# EAGLE schematic Rephone core 2G-AtmelSAMD21 v1.0 (EAGLE 6.4)
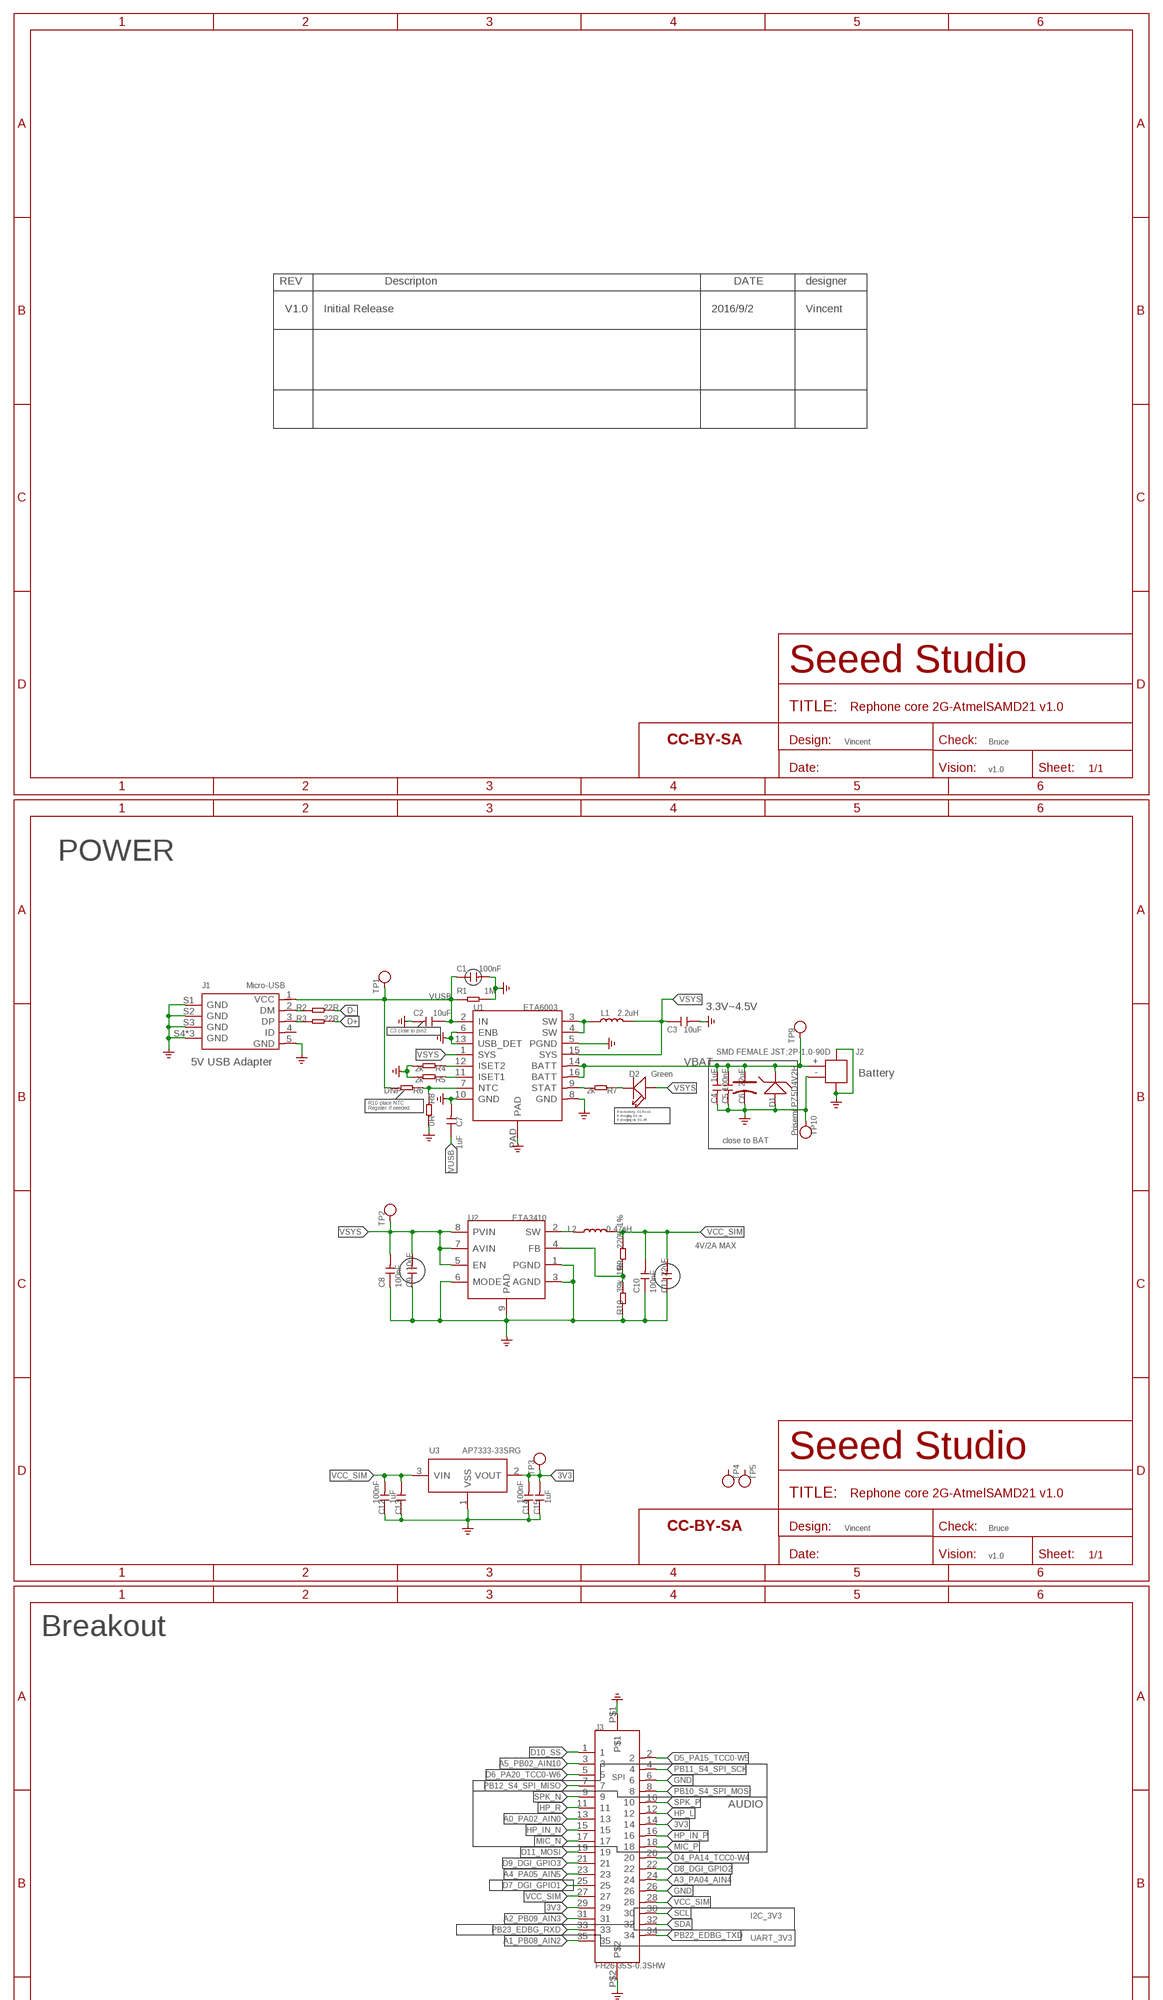
[diagram p0: schematic, sheet 1, part 1 of 2]
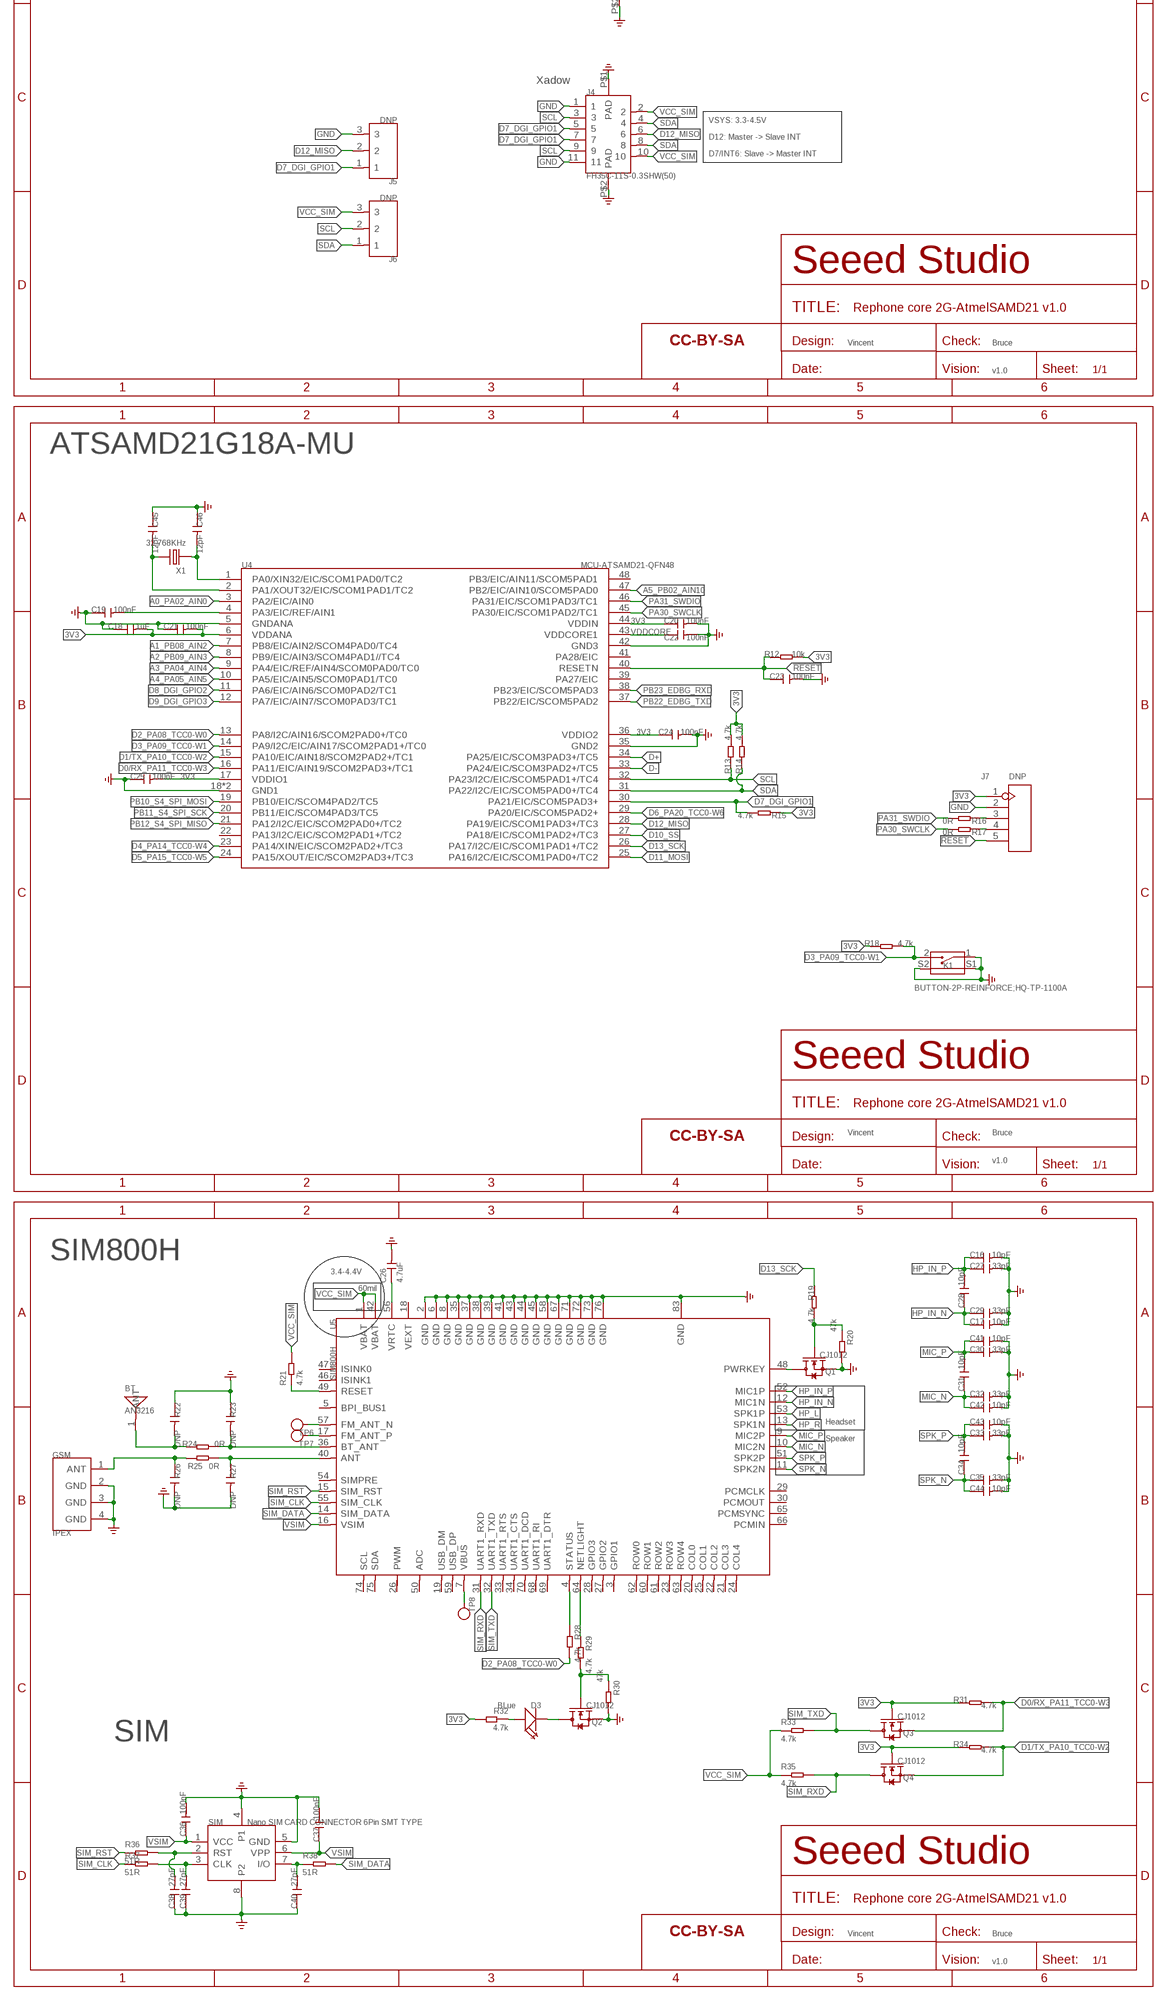
[diagram p1: schematic, sheet 1, part 2 of 2]

## Parts
BT  AN3216  ANTENNA-AN3216  [ANT-SMD2P-3.2X1.6X1.04MM]
C1  100nF  CAP-0201  [C0201]
C2  10uF  C-0603  [C0603]
C3  10uF  C-0603  [C0603]
C4  1uF  C-0402  [C0402]
C5  100nF  CAP-0201  [C0201]
C6  22uF  CAP-POLAR-AVX-A  [AVX-A]
C7  1uF  C-0402  [C0402]
C8  100nF  CAP-0201  [C0201]
C9  10uF  C-0603  [C0603]
C10  100nF  CAP-0201  [C0201]
C11  22uF  C-0603  [C0603]
C12  100nF  CAP-0201  [C0201]
C13  1uF  C-0402  [C0402]
C14  100nF  CAP-0201  [C0201]
C15  1uF  C-0402  [C0402]
C16  10pF  CAP-0201  [C0201]
C17  10pF  CAP-0201  [C0201]
C18  1uF  C-0402  [C0402]
C19  100nF  CAP-0201  [C0201]
C20  100nF  CAP-0201  [C0201]
C21  100nF  CAP-0201  [C0201]
C22  100nF  CAP-0201  [C0201]
C23  100nF  CAP-0201  [C0201]
C24  100nF  CAP-0201  [C0201]
C25  100nF  CAP-0201  [C0201]
C26  4.7uF  CAP-0603  [C0603]
C27  33pF  CAP-0201  [C0201]
C28  10pF  CAP-0201  [C0201]
C29  33pF  CAP-0201  [C0201]
C30  33pF  CAP-0201  [C0201]
C31  10pF  CAP-0201  [C0201]
C32  33pF  CAP-0201  [C0201]
C33  33pF  CAP-0201  [C0201]
C34  10pF  CAP-0201  [C0201]
C35  33pF  CAP-0201  [C0201]
C36  100nF  CAP-0201  [C0201]
C37  100nF  CAP-0201  [C0201]
C38  27pF  CAP-0201  [C0201]
C39  27pF  CAP-0201  [C0201]
C40  27pF  CAP-0201  [C0201]
C41  10pF  CAP-0201  [C0201]
C42  10pF  CAP-0201  [C0201]
C43  10pF  CAP-0201  [C0201]
C44  10pF  CAP-0201  [C0201]
C45  12pF  CAP-0201  [C0201]
C46  12pF  CAP-0201  [C0201]
D1  Prisemi;PZ5D4V2H  D-ZENER-2P'BZX584CX'  [SOD-523]
D2  Green  LED-0402  [LED-0402]
D3  BLue  LED-0402  [LED-0402]
FR1  SEEEDSTUDIO-OPEN-SCH-FRAME  [SEEEDSTUDIO-PCB-FRAME]
FR2  SEEEDSTUDIO-OPEN-SCH-FRAME  [SEEEDSTUDIO-PCB-FRAME]
FR3  SEEEDSTUDIO-OPEN-SCH-FRAME  [SEEEDSTUDIO-PCB-FRAME]
FR4  SEEEDSTUDIO-OPEN-SCH-FRAME  [SEEEDSTUDIO-PCB-FRAME]
FR5  SEEEDSTUDIO-OPEN-SCH-FRAME  [SEEEDSTUDIO-PCB-FRAME]
GSM  IPEX  ANT_IPEX  [ANT-IPEX4-1.7X1.7MM]
J1  Micro-USB  MICRO-USB5+4P5+4P  [MICRO-USB5+4P-SMD-0.65-B]
J2  SMD FEMALE JST;2P-1.0-90D  JST-2P-SMD'1.0'  [HW2-SMD-1.0-90D]
J3  FH26-35S-0.3SHW  FPC-CONNECTER-35P(FH26W-35S-0.3SHW(10))  [FPC35-SMD-0.3(FH26W)]
J4  FH35C-11S-0.3SHW(50)  FPC-CONNECTER-11P(FH35C-11S-0.3SHW(50))  [FPC11-SMD-0.3(FH35C)]
J5  DNP  HEADER3  [3P-DIP-2]
J6  DNP  HEADER3  [3P-DIP-2]
J7  DNP  HEADER-5P-TEST  [H5-SMD-2.0-TEST]
K1  BUTTON-2P-REINFORCE;HQ-TP-1100A  BUTTON-2+2P'HQ-TP-1100A'  [SW4-SMD-4.5X3.8X1.8MM-90D]
L1  2.2uH  INDUCTOR/FERRITE-BEAD'0805'  [L0805]
L2  0.47uH  L-MPM201610SR33_T  [L201610]
Q1  CJ1012  MOSFET-N  [SOT-523]
Q2  CJ1012  MOSFET-N  [SOT-523]
Q3  CJ1012  MOSFET-N  [SOT-523]
Q4  CJ1012  MOSFET-N  [SOT-523]
R1  1M  RES-0201  [R0201]
R2  22R  RES-0201  [R0201]
R3  22R  RES-0201  [R0201]
R4  2k  RES-0201  [R0201]
R5  2k  RES-0201  [R0201]
R6  DNP  RES-0201  [R0201]
R7  2k  RES-0201  [R0201]
R8  0R  RES-0201  [R0201]
R9  220k_1%  RES-0201  [R0201]
R10  39k_1%  RES-0201  [R0201]
R12  10k  RES-0201  [R0201]
R13  4.7k  RES-0201  [R0201]
R14  4.7k  RES-0201  [R0201]
R15  4.7k  RES-0201  [R0201]
R16  0R  RES-0201  [R0201]
R17  0R  RES-0201  [R0201]
R18  4.7k  RES-0201  [R0201]
R19  4.7k  RES-0201  [R0201]
R20  47k  RES-0201  [R0201]
R21  4.7k  RES-0201  [R0201]
R22  DNP  CAP-0201  [C0201]
R23  DNP  CAP-0201  [C0201]
R24  0R  RES-0201  [R0201]
R25  0R  RES-0201  [R0201]
R26  DNP  CAP-0201  [C0201]
R27  DNP  CAP-0201  [C0201]
R28  4.7k  RES-0201  [R0201]
R29  4.7k  RES-0201  [R0201]
R30  47k  RES-0201  [R0201]
R31  4.7k  RES-0201  [R0201]
R32  4.7k  RES-0201  [R0201]
R33  4.7k  RES-0201  [R0201]
R34  4.7k  RES-0201  [R0201]
R35  4.7k  RES-0201  [R0201]
R36  51R  RES-0201  [R0201]
R37  51R  RES-0201  [R0201]
R38  51R  RES-0201  [R0201]
SIM  Nano SIM CARD CONNECTOR 6Pin SMT TYPE  NANO-SIM-6+2P-SMD  [NANO-SIM6+2P-SMD-12.3X10X1.5MM]
TP1  TEST-POINT-23  [TP-D23MIL]
TP2  TEST-POINT-23  [TP-D23MIL]
TP3  TEST-POINT-23  [TP-D23MIL]
TP4  TEST-POINT-23  [TP-D23MIL]
TP5  TEST-POINT-23  [TP-D23MIL]
TP6  TEST-POINT'4545'  [TP-D45MIL]
TP7  TEST-POINT'4545'  [TP-D45MIL]
TP8  TEST-POINT-23  [TP-D23MIL]
TP9  TEST-POINT-23  [TP-D23MIL]
TP10  TEST-POINT-23  [TP-D23MIL]
U1  ETA6003  PMIC-ETA6003  [QFN16GA-0.5-3X3MM]
U2  ETA3410  CONVERTER-ETA3410  [DFN8G-0.5-2X2MM]
U3  AP7333-33SRG  PMIC-XC6206PMR  [SOT-23]
U4  MCU-ATSAMD21-QFN48  [QFN48-7X7]
U5  SIM800H  MOUDLE-GPRS-SIM800H  [GPRS88-SMD-1.4-17.8X45.8X2.4MM]
X1  32.768KHz  CRYSTAL-2P'NX2012SA'  [X2-SMD-L2.0X1.2X0.55MM]

## Nets
3V3: C14.2 C15.2 C18.2 C20.1 C21.2 C24.1 C25.2 J3.14 J3.29 J7.1 Q3.1(G) Q4.1(G) R12.1 R13.2 R14.2 R15.1 R18.1 R31.1 R32.2 R34.1 TP3.T U3.2(VOUT) U4.6(VDDANA) U4.17(VDDIO1) U4.36(VDDIO2) U4.44(VDDIN)
!RESET: C23.1 J7.5 R12.2 U4.40(RESETN)
A0_PA02_AIN0: J3.13 U4.3(PA2/EIC/AIN0)
A1_PB08_AIN2: J3.35 U4.7(PB8/EIC/AIN2/SCOM4PAD0/TC4)
A2_PB09_AIN3: J3.31 U4.8(PB9/EIC/AIN3/SCOM4PAD1//TC4)
A3_PA04_AIN4: J3.24 U4.9(PA4/EIC/REF/AIN4/SCOM0PAD0/TC0)
A4_PA05_AIN5: J3.23 U4.10(PA5/EIC/AIN5/SCOM0PAD1/TC0)
A5_PB02_AIN10: J3.3 U4.47(PB2/EIC/AIN10/SCOM5PAD0)
D0/RX_PA11_TCC0-W3: Q3.2(S) R31.2 U4.16(PA11/EIC/AIN19/SCOM2PAD3+/TC1)
D1/TX_PA10_TCC0-W2: Q4.2(S) R34.2 U4.15(PA10/EIC/AIN18/SCOM2PAD2+/TC1)
D2_PA08_TCC0-W0: R28.2 U4.13(PA8/I2C/AIN16/SCOM2PAD0+/TC0)
D3_PA09_TCC0-W1: K1.2 R18.2 U4.14(PA9/I2C/EIC/AIN17/SCOM2PAD1+/TC0)
D4_PA14_TCC0-W4: J3.20 U4.23(PA14/XIN/EIC/SCOM2PAD2+/TC3)
D5_PA15_TCC0-W5: J3.2 U4.24(PA15/XOUT/EIC/SCOM2PAD3+/TC3)
D6_PA20_TCC0-W6: J3.5 U4.29(PA20/EIC/SCOM5PAD2+)
D7_DGI_GPIO1: J3.25 J4.5 J4.7 J5.1 R15.2 U4.30(PA21/EIC/SCOM5PAD3+)
D8_DGI_GPIO2: J3.22 U4.11(PA6/EIC/AIN6/SCOM0PAD2/TC1)
D9_DGI_GPIO3: J3.21 U4.12(PA7/EIC/AIN7/SCOM0PAD3/TC1)
D10_SS: J3.1 U4.27(PA18/EIC/SCOM1PAD2+/TC3)
D11_MOSI: J3.19 U4.25(PA16/I2C/EIC/SCOM1PAD0+/TC2)
D12_MISO: J4.6 J5.2 U4.28(PA19/EIC/SCOM1PAD3+/TC3)
D13_SCK: R19.1 U4.26(PA17/I2C/EIC/SCOM1PAD1+/TC2)
D+: R3.2 U4.34(PA25/EIC/SCOM3PAD3+/TC5)
D-: R2.2 U4.33(PA24/EIC/SCOM3PAD2+/TC5)
GND: C1.2 C2.2 C3.2 C4.2 C5.2 C6.- C7.2 C8.1 C9.1 C10.1 C11.1 C12.1 C13.1 C14.1 C15.1 C16.2 C17.2 C18.1 C19.1 C20.2 C21.1 C22.2 C23.2 C24.2 C25.1 C26.2 C27.2 C29.2 C30.2 C32.2 C33.2 C35.2 C36.2 C37.2 C38.1 C39.1 C40.1 C41.2 C42.2 C43.2 C44.2 C45.1 C46.1 D1.+ GSM.2(GND) GSM.3(GND) GSM.4(GND) J1.5(GND) J1.S1(GND) J1.S2(GND) J1.S3(GND) J1.S4(GND) J1.S5(GND) J1.S6(GND) J2.3 J2.4 J2.- J3.6 J3.26 J3.P$1 J3.P$2 J4.1 J4.11 J4.P$1(PAD) J4.P$2(PAD) J5.3 J7.2 K1.1 K1.S1 K1.S2 Q1.2(S) Q2.2(S) R1.2 R4.2 R5.2 R8.2 R10.1 R20.2 R22.1 R23.1 R26.2 R27.2 R30.2 SIM.4(P1) SIM.5(GND) SIM.8(P2) TP10.T U1.5(PGND) U1.6(ENB) U1.8(GND) U1.10(GND) U1.13(USB_DET) U1.PAD U2.1(PGND) U2.3(AGND) U2.6(MODE) U2.9(PAD) U3.1(VSS) U4.5(GNDANA) U4.18(GND1) U4.35(GND2) U4.42(GND3) U4.PAD(GND1) U5.2(GND) U5.6(GND) U5.8(GND) U5.35(GND) U5.37(GND) U5.38(GND) U5.39(GND) U5.41(GND) U5.43(GND) U5.44(GND) U5.45(GND) U5.58(GND) U5.67(GND) U5.71(GND) U5.72(GND) U5.73(GND) U5.76(GND) U5.83(GND) ; supply symbol labelled GND_POWER
HP_IN_N: C17.1 C28.1 C29.1 J3.15 U5.12(MIC1N)
HP_IN_P: C16.1 C27.1 C28.2 J3.16 U5.52(MIC1P)
HP_L: J3.12 U5.53(SPK1P)
HP_R: J3.11 U5.13(SPK1N)
MIC_N: C31.1 C32.1 C42.1 J3.17 U5.10(MIC2N)
MIC_P: C30.1 C31.2 C41.1 J3.18 U5.9(MIC2P)
N$1: L2.1 U2.2(SW)
N$3: Q1.3(D) U5.48(PWRKEY)
N$4: R9.1 R10.2 U2.4(FB)
N$5: TP8.T U5.7(VBUS)
N$6: C26.1 U5.56(VRTC)
N$7: C19.2 U4.4(PA3/EIC/REF/AIN1)
N$8: TP6.T U5.57(FM_ANT_N)
N$9: TP7.T U5.17(FM_ANT_P)
N$10: C39.2 R37.2 SIM.3(CLK)
N$12: C38.2 R36.2 SIM.2(RST)
N$18: Q2.1(G) R29.2 R30.1
N$19: R4.1 U1.12(ISET2)
N$20: D3.+ R32.1
N$21: D3.- Q2.3(D)
N$22: R5.1 U1.11(ISET1)
N$23: L1.1 U1.3(SW) U1.4(SW)
N$24: R7.2 U1.9(STAT)
N$25: D2.- R7.1
N$31: R6.1 R8.1 U1.7(NTC)
N$32: R29.1 U5.64(NETLIGHT)
N$33: R21.1 U5.49(RESET)
N$34: Q1.1(G) R19.2 R20.1
N$35: J1.2(DM) R2.1
N$36: J1.3(DP) R3.1
N$37: C46.2 U4.1(PA0/XIN32/EIC/SCOM1PAD0/TC2) X1.1
N$38: R28.1 U5.4(STATUS)
N$39: BT.1(ANT) R22.2 R24.2
N$40: GSM.1(ANT) R25.2 R26.1
N$41: R25.1 R27.1 U5.40(ANT)
N$42: R23.2 R24.1 U5.36(BT_ANT)
N$43: C40.2 R38.1 SIM.7(I/O)
N$44: J7.3 R16.1
N$45: J7.4 R17.1
N$46: C45.2 U4.2(PA1/XOUT32/EIC/SCOM1PAD1/TC2) X1.2
PA30_SWCLK: R17.2 U4.45(PA30/EIC/SCOM1PAD2/TC1)
PA31_SWDIO: R16.2 U4.46(PA31/EIC/SCOM1PAD3/TC1)
PB10_S4_SPI_MOSI: J3.8 U4.19(PB10/EIC/SCOM4PAD2/TC5)
PB11_S4_SPI_SCK: J3.4 U4.20(PB11/EIC/SCOM4PAD3/TC5)
PB12_S4_SPI_MISO: J3.7 U4.21(PA12/I2C/EIC/SCOM2PAD0+/TC2)
PB22_EDBG_TXD: J3.34 U4.37(PB22/EIC/SCOM5PAD2)
PB23_EDBG_RXD: J3.33 U4.38(PB23/EIC/SCOM5PAD3)
SCL: J3.30 J4.3 J4.9 J6.2 R13.1 U4.32(PA23/I2C/EIC/SCOM5PAD1+/TC4)
SDA: J3.32 J4.4 J4.8 J6.1 R14.1 U4.31(PA22/I2C/EIC/SCOM5PAD0+/TC4)
SIM_CLK: R37.1 U5.55(SIM_CLK)
SIM_DATA: R38.2 U5.14(SIM_DATA)
SIM_RST: R36.1 U5.15(SIM_RST)
SIM_RXD: Q4.3(D) R35.2 U5.31(UART1_RXD)
SIM_TXD: Q3.3(D) R33.2 U5.32(UART1_TXD)
SPK_N: C34.1 C35.1 C44.1 J3.9 U5.11(SPK2N)
SPK_P: C33.1 C34.2 C43.1 J3.10 U5.51(SPK2P)
VBAT: C4.1 C5.1 C6.+ D1.- J2.+ TP9.T U1.14(BATT) U1.16(BATT)
VCC_SIM: C10.2 C11.2 C12.2 C13.2 J3.27 J3.28 J4.2 J4.10 J6.3 L2.2 R9.2 R21.2 R33.1 R35.1 U3.3(VIN) U5.1(VBAT) U5.42(VBAT)
VDDCORE: C22.1 U4.43(VDDCORE1)
VSIM: C36.1 C37.1 SIM.1(VCC) SIM.6(VPP) U5.16(VSIM)
VSYS: C3.1 C8.2 C9.2 D2.+ L1.2 TP2.T U1.1(SYS) U1.15(SYS) U2.5(EN) U2.7(AVIN) U2.8(PVIN)
VUSB: C1.1 C2.1 C7.1 J1.1(VCC) R1.1 R6.2 TP1.T U1.2(IN)
Unconnected: J1.4(ID) TP4.T TP5.T U4.22(PA13/I2C/EIC/SCOM2PAD1+/TC2) U4.39(PA27/EIC) U4.41(PA28/EIC) U4.48(PB3/EIC/AIN11/SCOM5PAD1) U5.3(GPIO1) U5.5(BPI_BUS1) U5.18(VEXT) U5.19(USB_DM) U5.20(COL0) U5.21(COL3) U5.22(COL2) U5.23(ROW3) U5.24(COL4) U5.25(COL1) U5.26(PWM) U5.27(GPIO2) U5.28(GPIO3) U5.29(PCMCLK) U5.30(PCMOUT) U5.33(UART1_RTS) U5.34(UART1_CTS) U5.46(ISINK1) U5.47(ISINK0) U5.50(ADC) U5.54(SIMPRE) U5.59(USB_DP) U5.60(ROW1) U5.61(ROW2) U5.62(ROW0) U5.63(ROW4) U5.65(PCMSYNC) U5.66(PCMIN) U5.68(UART1_RI) U5.69(UART1_DTR) U5.70(UART1_DCD) U5.74(SCL) U5.75(SDA)

## Notes on the sheet
- REV | Descripton | DATE | designer
- V1.0 | Initial Release | 2016/9/2 | Vincent
- Vincent | Bruce
- v1.0
- POWER
- 3.3V~4.5V
- C3 close to pin2
- 5V USB Adapter
- Battery
- R10 place NTC 
  Register if needed.
- if no battery, D1 flash.
  if charging, D1 on.
  if charging ok, D1 off.
- close to BAT
- 4V/2A MAX
- Vincent | Bruce
- v1.0
- Breakout
- SPI
- AUDIO
- I2C_3V3
- UART_3V3
- Xadow
- VSYS: 3.3-4.5V
- D12: Master -> Slave INT
- D7/INT6: Slave -> Master INT
- Vincent | Bruce
- v1.0
- ATSAMD21G18A-MU
- Vincent | Bruce
- v1.0
- SIM800H
- 3.4-4.4V
- 60mil
- Headset
- Speaker
- SIM
- Vincent | Bruce
- v1.0

## Library data of the parts
BT = template:ANTENNA-AN3216
C1 C5 C8 C10 C12 C14 C16 C17 C19-C46 R22 R23 R26 R27 = Discrete-new:CAP: Ceramic Capacitors
C2-C4 C7 C9 C11 C13 C15 C18 = Discrete-smallsmall:C*: Ceramic Capacitors
C6 = Discrete-new:CAP-POLAR: Electrolytic Capacitors,Tantalum Capacitors and Super Capacitors
D1 = Discrete-new:D-ZENER-2P: SOD-123:304030008;SOT-23:304030000
D2 D3 = Discrete-new:LED
FR1-FR5 = moudle-new:SEEEDSTUDIO-OPEN-SCH-FRAME
GSM = template:ANT_IPEX
J1 = Connector-new:MICRO-USB5+4P: 5+4P-SMD-0.65-B:320010000;5+2P-SMD-0.65-AB:340032001
J2 = Connector-new:JST-2P-SMD: 2P-SMD-1.0-90D:320110054;2P-SMD-2.0-90D:320110026
J3 = template:FPC-CONNECTER-35P(FH26W-35S-0.3SHW(10))
J4 = template:FPC-CONNECTER-11P(FH35C-11S-0.3SHW(50))
J5 J6 = template:HEADER3
J7 = Connector-new:HEADER-5P
K1 = Discrete-new:BUTTON-2+2P: SW4-SMD-4.5X3.8X1.8MM-90D:311020035;SW4-SMD-7.0X3.5X3.5MM-90D:311020023
L1 = Discrete-new:INDUCTOR/FERRITE-BEAD
L2 = Discrete-new:L
Q1-Q4 = template:MOSFET-N: IRLL014: http://www.vishay.com/docs/91319/sihll014.pdf
R1-R10 R12-R21 R24 R25 R28-R38 = Discrete-new:RES
SIM = template:NANO-SIM-6+2P-SMD
TP1-TP5 TP8-TP10 = Discrete-new:TEST-POINT
TP6 TP7 = Discrete-new:TEST-POINT; PARTNO: DNP
U1 = template:PMIC-ETA6003: 310990023
U2 = template:CONVERTER-ETA3410: 3MHZ 2A High Step-Down Converter in DFN2x2-8L Package
U3 = IC-new:PMIC-XC6206P: LOW ESR Cap.Compatible Positive Voltage Regulators
U4 = IC-new:MCU-ATSAMD21: Atmel D21 32bit ARM Cortex-M0 microcontroller - 48 PIN TQFP 256KB flash memory + 32KB SRAM
U5 = moudle-new:MOUDLE-GPRS-SIM800H
X1 = Discrete-new:CRYSTAL-2P